# Altium schematic sheet pullupcount.SchDoc
size A4; SheetNumber: 1; SheetTotal: 1
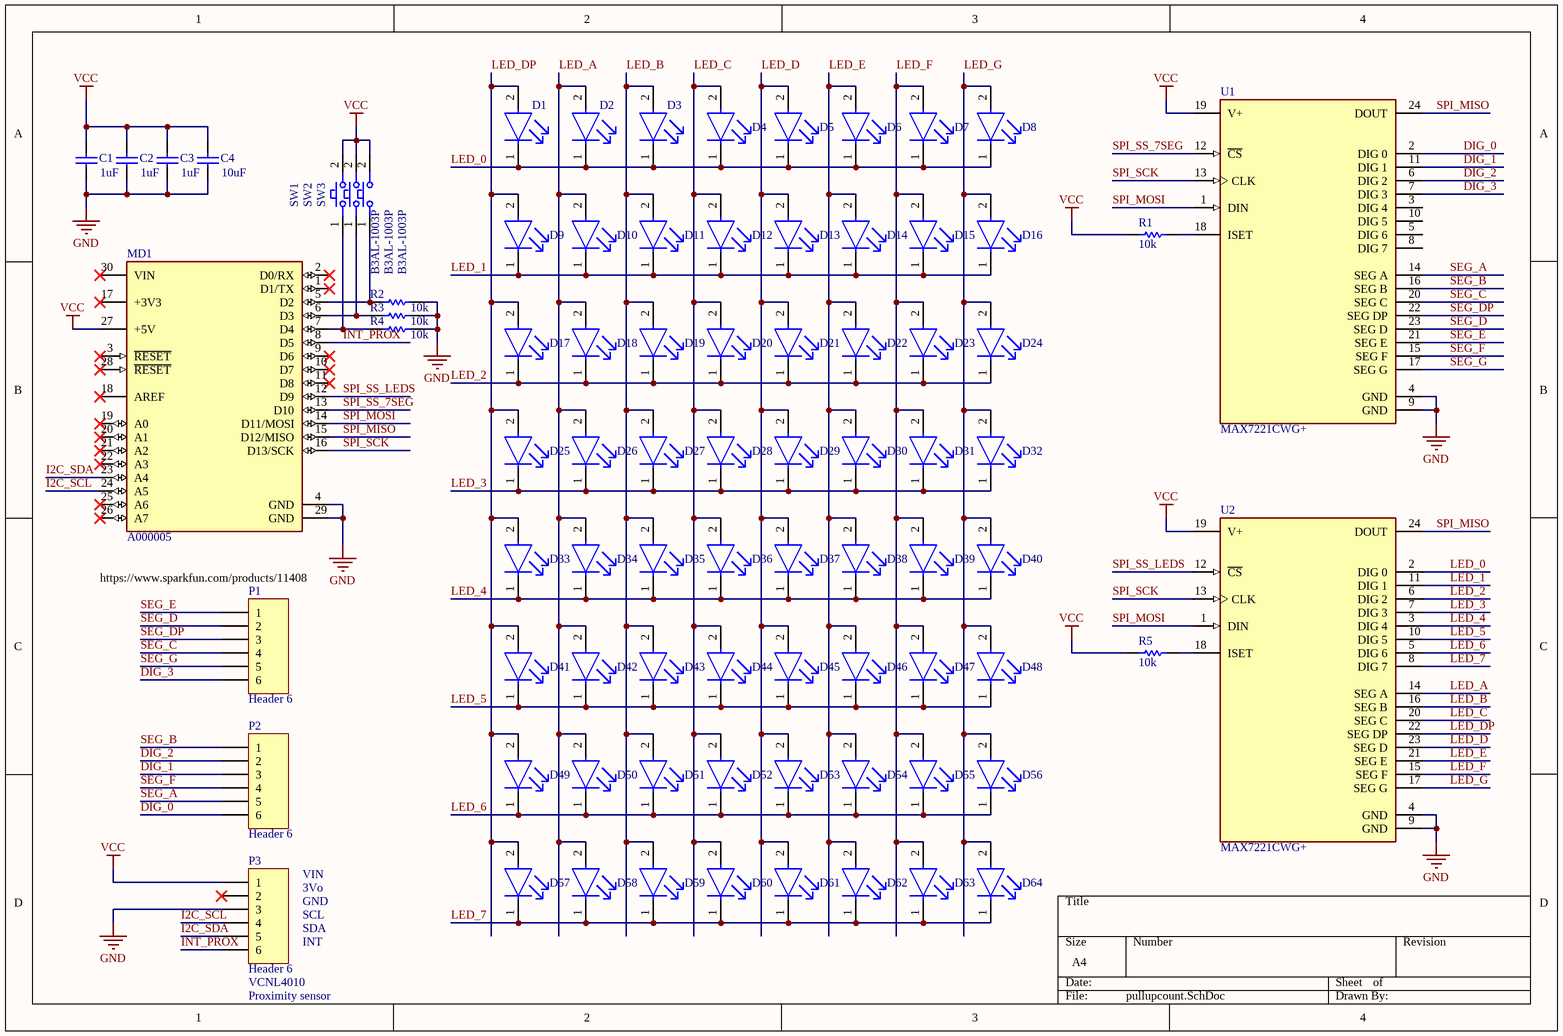
[diagram p0: pullupcount.SchDoc]

## Parts
C1  value 1uF  [CAPC1608X90X35LL10T15]  (hidden comment: GRM188R61E105KA12D)
C2  value 1uF  [CAPC1608X90X35LL10T15]  (hidden comment: GRM188R61E105KA12D)
C3  value 1uF  [CAPC1608X90X35LL10T15]  (hidden comment: GRM188R61E105KA12D)
C4  value 10uF  [CAPC1608X90X35LL10T15]  (hidden comment: GRM188R61E105KA12D)
D1  LTST-C191TBKT  [FP-LTST-C191TBKT-MFG]  (value not drawn)
D2  LTST-C191TBKT  [FP-LTST-C191TBKT-MFG]  (value not drawn)
D3  LTST-C191TBKT  [FP-LTST-C191TBKT-MFG]  (value not drawn)
D4  LTST-C191TBKT  [FP-LTST-C191TBKT-MFG]  (value not drawn)
D5  LTST-C191TBKT  [FP-LTST-C191TBKT-MFG]  (value not drawn)
D6  LTST-C191TBKT  [FP-LTST-C191TBKT-MFG]  (value not drawn)
D7  LTST-C191TBKT  [FP-LTST-C191TBKT-MFG]  (value not drawn)
D8  LTST-C191TBKT  [FP-LTST-C191TBKT-MFG]  (value not drawn)
D9  LTST-C191TBKT  [FP-LTST-C191TBKT-MFG]  (value not drawn)
D10  LTST-C191TBKT  [FP-LTST-C191TBKT-MFG]  (value not drawn)
D11  LTST-C191TBKT  [FP-LTST-C191TBKT-MFG]  (value not drawn)
D12  LTST-C191TBKT  [FP-LTST-C191TBKT-MFG]  (value not drawn)
D13  LTST-C191TBKT  [FP-LTST-C191TBKT-MFG]  (value not drawn)
D14  LTST-C191TBKT  [FP-LTST-C191TBKT-MFG]  (value not drawn)
D15  LTST-C191TBKT  [FP-LTST-C191TBKT-MFG]  (value not drawn)
D16  LTST-C191TBKT  [FP-LTST-C191TBKT-MFG]  (value not drawn)
D17  LTST-C191TBKT  [FP-LTST-C191TBKT-MFG]  (value not drawn)
D18  LTST-C191TBKT  [FP-LTST-C191TBKT-MFG]  (value not drawn)
D19  LTST-C191TBKT  [FP-LTST-C191TBKT-MFG]  (value not drawn)
D20  LTST-C191TBKT  [FP-LTST-C191TBKT-MFG]  (value not drawn)
D21  LTST-C191TBKT  [FP-LTST-C191TBKT-MFG]  (value not drawn)
D22  LTST-C191TBKT  [FP-LTST-C191TBKT-MFG]  (value not drawn)
D23  LTST-C191TBKT  [FP-LTST-C191TBKT-MFG]  (value not drawn)
D24  LTST-C191TBKT  [FP-LTST-C191TBKT-MFG]  (value not drawn)
D25  LTST-C191TBKT  [FP-LTST-C191TBKT-MFG]  (value not drawn)
D26  LTST-C191TBKT  [FP-LTST-C191TBKT-MFG]  (value not drawn)
D27  LTST-C191TBKT  [FP-LTST-C191TBKT-MFG]  (value not drawn)
D28  LTST-C191TBKT  [FP-LTST-C191TBKT-MFG]  (value not drawn)
D29  LTST-C191TBKT  [FP-LTST-C191TBKT-MFG]  (value not drawn)
D30  LTST-C191TBKT  [FP-LTST-C191TBKT-MFG]  (value not drawn)
D31  LTST-C191TBKT  [FP-LTST-C191TBKT-MFG]  (value not drawn)
D32  LTST-C191TBKT  [FP-LTST-C191TBKT-MFG]  (value not drawn)
D33  LTST-C191TBKT  [FP-LTST-C191TBKT-MFG]  (value not drawn)
D34  LTST-C191TBKT  [FP-LTST-C191TBKT-MFG]  (value not drawn)
D35  LTST-C191TBKT  [FP-LTST-C191TBKT-MFG]  (value not drawn)
D36  LTST-C191TBKT  [FP-LTST-C191TBKT-MFG]  (value not drawn)
D37  LTST-C191TBKT  [FP-LTST-C191TBKT-MFG]  (value not drawn)
D38  LTST-C191TBKT  [FP-LTST-C191TBKT-MFG]  (value not drawn)
D39  LTST-C191TBKT  [FP-LTST-C191TBKT-MFG]  (value not drawn)
D40  LTST-C191TBKT  [FP-LTST-C191TBKT-MFG]  (value not drawn)
D41  LTST-C191TBKT  [FP-LTST-C191TBKT-MFG]  (value not drawn)
D42  LTST-C191TBKT  [FP-LTST-C191TBKT-MFG]  (value not drawn)
D43  LTST-C191TBKT  [FP-LTST-C191TBKT-MFG]  (value not drawn)
D44  LTST-C191TBKT  [FP-LTST-C191TBKT-MFG]  (value not drawn)
D45  LTST-C191TBKT  [FP-LTST-C191TBKT-MFG]  (value not drawn)
D46  LTST-C191TBKT  [FP-LTST-C191TBKT-MFG]  (value not drawn)
D47  LTST-C191TBKT  [FP-LTST-C191TBKT-MFG]  (value not drawn)
D48  LTST-C191TBKT  [FP-LTST-C191TBKT-MFG]  (value not drawn)
D49  LTST-C191TBKT  [FP-LTST-C191TBKT-MFG]  (value not drawn)
D50  LTST-C191TBKT  [FP-LTST-C191TBKT-MFG]  (value not drawn)
D51  LTST-C191TBKT  [FP-LTST-C191TBKT-MFG]  (value not drawn)
D52  LTST-C191TBKT  [FP-LTST-C191TBKT-MFG]  (value not drawn)
D53  LTST-C191TBKT  [FP-LTST-C191TBKT-MFG]  (value not drawn)
D54  LTST-C191TBKT  [FP-LTST-C191TBKT-MFG]  (value not drawn)
D55  LTST-C191TBKT  [FP-LTST-C191TBKT-MFG]  (value not drawn)
D56  LTST-C191TBKT  [FP-LTST-C191TBKT-MFG]  (value not drawn)
D57  LTST-C191TBKT  [FP-LTST-C191TBKT-MFG]  (value not drawn)
D58  LTST-C191TBKT  [FP-LTST-C191TBKT-MFG]  (value not drawn)
D59  LTST-C191TBKT  [FP-LTST-C191TBKT-MFG]  (value not drawn)
D60  LTST-C191TBKT  [FP-LTST-C191TBKT-MFG]  (value not drawn)
D61  LTST-C191TBKT  [FP-LTST-C191TBKT-MFG]  (value not drawn)
D62  LTST-C191TBKT  [FP-LTST-C191TBKT-MFG]  (value not drawn)
D63  LTST-C191TBKT  [FP-LTST-C191TBKT-MFG]  (value not drawn)
D64  LTST-C191TBKT  [FP-LTST-C191TBKT-MFG]  (value not drawn)
MD1  A000005  [FP-A000005-MFG]
P1  Header 6  [HDR1X6]
P2  Header 6  [HDR1X6]
P3  Header 6  [HDR1X6]
R1  10k  [RESC1609X50X30NL8T20]
R2  10k  [RESC1609X50X30NL8T20]
R3  10k  [RESC1609X50X30NL8T20]
R4  10k  [RESC1609X50X30NL8T20]
R5  10k  [RESC1609X50X30NL8T20]
SW1  B3AL-1003P  [FP-B3AL-1003P-MFG]
SW2  B3AL-1003P  [FP-B3AL-1003P-MFG]
SW3  B3AL-1003P  [FP-B3AL-1003P-MFG]
U1  MAX7221CWG+  [FP-W24-1-MFG]
U2  MAX7221CWG+  [FP-W24-1-MFG]

## Nets
GND: C1.1 C2.1 C3.1 C4.1 MD1.4(GND) MD1.29(GND) P3.3 R2.1 R3.1 R4.1 U1.4(GND) U1.9(GND) U2.4(GND) U2.9(GND)
VCC: C1.2 C2.2 C3.2 C4.2 MD1.27(+5V) P3.1 R1.2 R5.2 SW1.2 SW2.2 SW3.2 U1.19(V+) U2.19(V+)
DIG_0: P2.6 U1.2(DIG_0)
DIG_1: P2.3 U1.11(DIG_1)
DIG_2: P2.2 U1.6(DIG_2)
DIG_3: P1.6 U1.7(DIG_3)
I2C_SCL: MD1.24(A5) P3.4
I2C_SDA: MD1.23(A4) P3.5
INT_PROX: MD1.8(D5) P3.6
LED_0: D1.1(C) D2.1(C) D3.1(C) D4.1(C) D5.1(C) D6.1(C) D7.1(C) D8.1(C) U2.2(DIG_0)
LED_1: D9.1(C) D10.1(C) D11.1(C) D12.1(C) D13.1(C) D14.1(C) D15.1(C) D16.1(C) U2.11(DIG_1)
LED_2: D17.1(C) D18.1(C) D19.1(C) D20.1(C) D21.1(C) D22.1(C) D23.1(C) D24.1(C) U2.6(DIG_2)
LED_3: D25.1(C) D26.1(C) D27.1(C) D28.1(C) D29.1(C) D30.1(C) D31.1(C) D32.1(C) U2.7(DIG_3)
LED_4: D33.1(C) D34.1(C) D35.1(C) D36.1(C) D37.1(C) D38.1(C) D39.1(C) D40.1(C) U2.3(DIG_4)
LED_5: D41.1(C) D42.1(C) D43.1(C) D44.1(C) D45.1(C) D46.1(C) D47.1(C) D48.1(C) U2.10(DIG_5)
LED_6: D49.1(C) D50.1(C) D51.1(C) D52.1(C) D53.1(C) D54.1(C) D55.1(C) D56.1(C) U2.5(DIG_6)
LED_7: D57.1(C) D58.1(C) D59.1(C) D60.1(C) D61.1(C) D62.1(C) D63.1(C) D64.1(C) U2.8(DIG_7)
LED_A: D2.2(A) D10.2(A) D18.2(A) D26.2(A) D34.2(A) D42.2(A) D50.2(A) D58.2(A) U2.14(SEG_A)
LED_B: D3.2(A) D11.2(A) D19.2(A) D27.2(A) D35.2(A) D43.2(A) D51.2(A) D59.2(A) U2.16(SEG_B)
LED_C: D4.2(A) D12.2(A) D20.2(A) D28.2(A) D36.2(A) D44.2(A) D52.2(A) D60.2(A) U2.20(SEG_C)
LED_D: D5.2(A) D13.2(A) D21.2(A) D29.2(A) D37.2(A) D45.2(A) D53.2(A) D61.2(A) U2.23(SEG_D)
LED_DP: D1.2(A) D9.2(A) D17.2(A) D25.2(A) D33.2(A) D41.2(A) D49.2(A) D57.2(A) U2.22(SEG_DP)
LED_E: D6.2(A) D14.2(A) D22.2(A) D30.2(A) D38.2(A) D46.2(A) D54.2(A) D62.2(A) U2.21(SEG_E)
LED_F: D7.2(A) D15.2(A) D23.2(A) D31.2(A) D39.2(A) D47.2(A) D55.2(A) D63.2(A) U2.15(SEG_F)
LED_G: D8.2(A) D16.2(A) D24.2(A) D32.2(A) D40.2(A) D48.2(A) D56.2(A) D64.2(A) U2.17(SEG_G)
SEG_A: P2.5 U1.14(SEG_A)
SEG_B: P2.1 U1.16(SEG_B)
SEG_C: P1.4 U1.20(SEG_C)
SEG_D: P1.2 U1.23(SEG_D)
SEG_DP: P1.3 U1.22(SEG_DP)
SEG_E: P1.1 U1.21(SEG_E)
SEG_F: P2.4 U1.15(SEG_F)
SEG_G: P1.5 U1.17(SEG_G)
SPI_MISO: MD1.15(D12/MISO) U1.24(DOUT) U2.24(DOUT)
SPI_MOSI: MD1.14(D11/MOSI) U1.1(DIN) U2.1(DIN)
SPI_SCK: MD1.16(D13/SCK) U1.13(CLK) U2.13(CLK)
SPI_SS_7SEG: MD1.13(D10) U1.12(~{CS})
SPI_SS_LEDS: MD1.12(D9) U2.12(~{CS})
NetMD1_5: MD1.5(D2) R2.2 SW3.1
NetMD1_6: MD1.6(D3) R3.2 SW2.1
NetMD1_7: MD1.7(D4) R4.2 SW1.1
NetR1_1: R1.1 U1.18(ISET)
NetR5_1: R5.1 U2.18(ISET)

Not connected (* = marked no-connect by the designer): MD1 1(D1/TX)* 2(D0/RX)* 3(~{RESET})* 9(D6)* 10(D7)* 11(D8)* 17(+3V3)* 18(AREF)* 19(A0)* 20(A1)* 21(A2)* 22(A3)* 25(A6)* 26(A7)* 28(~{RESET})* 30(VIN)*; P3 2*; U1 3(DIG_4) 5(DIG_6) 8(DIG_7) 10(DIG_5)

## Notes on the sheet
- (near P1) https://www.sparkfun.com/products/11408
- VIN
- 3Vo
- GND
- SCL
- (near P3) VCNL4010
- SDA
- INT
- (near P3) Proximity sensor

## Library data of the parts
C1-C4 = CMP-2006-02459-1: Manufacturer: Murata; Part Number: GRM188R61E105KA12D
D1-D64 = CMP-22017-000008-1: LED BLUE CLEAR CHIP SMD; Lens Color: Colorless; Dominant Wavelength: 475nm; Forward Current: 20mA; Wavelength: 468nm; Viewing Angle: 130°; Power Dissipation: 76mW; Luminous Intensity: 180mcd; Reverse Voltage: 5V; Number of Elements: 1; Lens Style: Diffused; Forward Voltage: 3.8V; Max Power Dissipation: 75mW; Case Code (Metric): 1608; Packaging: Tape and Reel; Case/Package: 0603; Depth: 1.6mm; Mount: Surface Mount; Lead Free: Lead Free; Min Operating Temperature: -20°C; Lens Transparency: Clear; Illumination Color: Blue; Height: 0.55mm; Test Current: 20mA; Case Code (Imperial): 0603; Max Operating Temperature: 80°C; Number of Pins: 2; Length: 0.8mm; Radiation Hardening: No; Package Quantity: 1; Number of LEDs: 1; Width: 0.8mm; Color: Blue
MD1 = CMP-189986-000002-1: ARDUINO NANO ATMEGA328 EVAL BRD; Number of Bits: 8; Evaluation Kit: Yes; Operating Supply Voltage: 12V; Interface: I2C; Data Bus Width: 8b; Core Architecture: AVR; Packaging: Bulk; Length: 7inch; Package Quantity: 50; Width: 5inch; REACH SVHC: No SVHC; Weight: 0.358383oz; Series: AVR® ATmega; Height: 0.25inch
P1-P3 = Header 6: Header, 6-Pin; LatestRevisionDate: 17-Jul-2002; LatestRevisionNote: Re-released for DXP Platform.; Publisher: Altium Limited
R1-R5 = CMP-1666-00005-4: Chip Resistor, 10 KOhm, +/- 1%, 100 mW, -55 to 155 degC, 0603 (1608 Metric), RoHS, Tape and Reel; Manufacturer: Vishay Semiconductor; Voltage Rating: 75 V; Max Operating Temperature: 155 degC; PackageDescription: 2-Pin Surface Mount Device, Body 1.575 x 0.85 mm; ComponentLink1Description: Manufacturer URL; RoHSCompliant: true; PackageReference: 0603; REACH SVHC: Unknown; Length: 1.55 mm; DatasheetVersion: 06/2012; Packaging: Tape and Reel; Min Operating Temperature: -55 degC; Mounting Technology: Surface Mount; ComponentLink2URL: https://datasheet.ciiva.com/11809/0900766b80d98afc-11809037.pdf; Height: 0.45 mm; ComponentLink2Description: Datasheet; Package Quantity: 5000; ComponentLink1URL: http://www.vishay.com/
SW1-SW3 = CMP-08834-000018-1: SWITCH TACTILE SPST-NO 0.05A 16V; Contact Resistance: 100mR; Illumination Type: Non-Illuminated; Electrical Life: 1000000Cycles; Switch Function: Off-Mom; Switch Travel: 1.3mm; Contact Current Rating: 50mA; Actuator Color: White; Operating Force: 3.5N; Throw Configuration: SPST; Package Quantity: 1; Orientation: Straight; Radiation Hardening: No; Packaging: Tape and Reel; Max Voltage Rating (DC): 16V; Mechanical Life: 1000000Cycles; Min Operating Temperature: -40°C; Depth: 6.6mm; Voltage Rating (DC): 16V; Contact Plating: Silver; Mount: Surface Mount; Series: B3AL; Termination: SMD/SMT; Max Current Rating: 50mA; RoHS Compliant: Yes; Max Operating Temperature: 90°C; Current Rating: 50mA; Length: 6.9mm; Weight: 0.18g
U1 U2 = CMP-05718-000002-1: IC DRVR 7 SEGMNT 8 DIGIT 24SOIC; Manufacturer: Maxim Integrated; Nominal Supply Current: 330mA; Max Power Dissipation: 941mW; Standoff Height: 0.1mm; Min Supply Voltage: 4V; Max Supply Voltage: 5.5V; Max Junction Temp: +150°C; Number Of Outputs: 8; Lead Free: Yes; Device Class L2: Power Management ICs; Height: 2.65mm; Temperature: 0°C to +70°C; Category: IC; Ipc Land Pattern Name: SOIC127P1032X250-24; Temperature Range High: +70°C; Package: W24-1; Manufacturer Part Number: MAX7221CWG+; Device Class L3: LED Drivers; ComponentLink2URL: https://datasheets.maximintegrated.com/en/ds/MAX7219-MAX7221.pdf; Temperature Range Low: 0°C; Device Class L1: Integrated Circuits (ICs); ComponentLink2Description: Datasheet; Digikey Description: IC DRVR 7 SEGMNT 8 DIGIT 24SOIC; Mouser Description: In a Tube of 30, Maxim MAX7221CWG+, LED Driver, 8-Digits 64-Segments, 5 V, 24-Pin SOIC W; RoHS: TRUE; Octopart: https://octopart.com/max7221cwg%2B-maxim+integrated-39581478; Automotive: No; Footprint Url: https://pdfserv.maximintegrated.com/land_patterns/90-0182.PDF